# EAGLE design pcb5 (EAGLE 7.1.0)
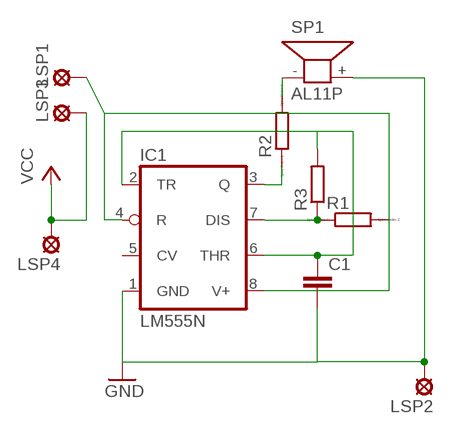
[diagram p0: schematic, sheet 1]

## Parts
C1  C-EU025-024X044  [C025-024X044]
IC1  LM555N  [DIL08]
LSP1  MCS08  [MCS08]
LSP2  MCS08  [MCS08]
LSP3  MCS08  [MCS08]
LSP4  MCS08  [MCS08]
R1  R-EU_0204_7  [0204/7]
R2  R-EU_0204_7  [0204/7]
R3  R-EU_0204/7  [0204/7]
SP1  AL11P  [AL11P]

## Nets
GND: C1.2 IC1.1(GND) LSP2.MP SP1.+
N$1: IC1.3(Q) R2.1
N$2: IC1.7(DIS) R1.1 R3.1
N$3: R2.2 SP1.-
N$4: C1.1 IC1.2(TR) IC1.6(THR) R3.2
N$7: IC1.4(R) IC1.8(V+) LSP1.MP R1.2
VCC: LSP3.MP LSP4.MP
Unconnected: IC1.5(CV)

## Library data of the parts
C1 = rcl:C-EU: CAPACITOR, European symbol
IC1 = linear:*555: TIMER
LSP1-LSP4 = solpad:MCS08: SOLDER PAD MC S0,8, drill 1.2 mm, distributor Buerklin, 08F130
R1 R2 = resistor:R-EU_: RESISTOR, European symbol; SPICEPREFIX: R
R3 = rcl:R-EU_: RESISTOR, European symbol
SP1 = buzzer:AL11P: SPEAKER Source: Buerklin; OC_FARNELL: unknown; OC_NEWARK: unknown

## Board
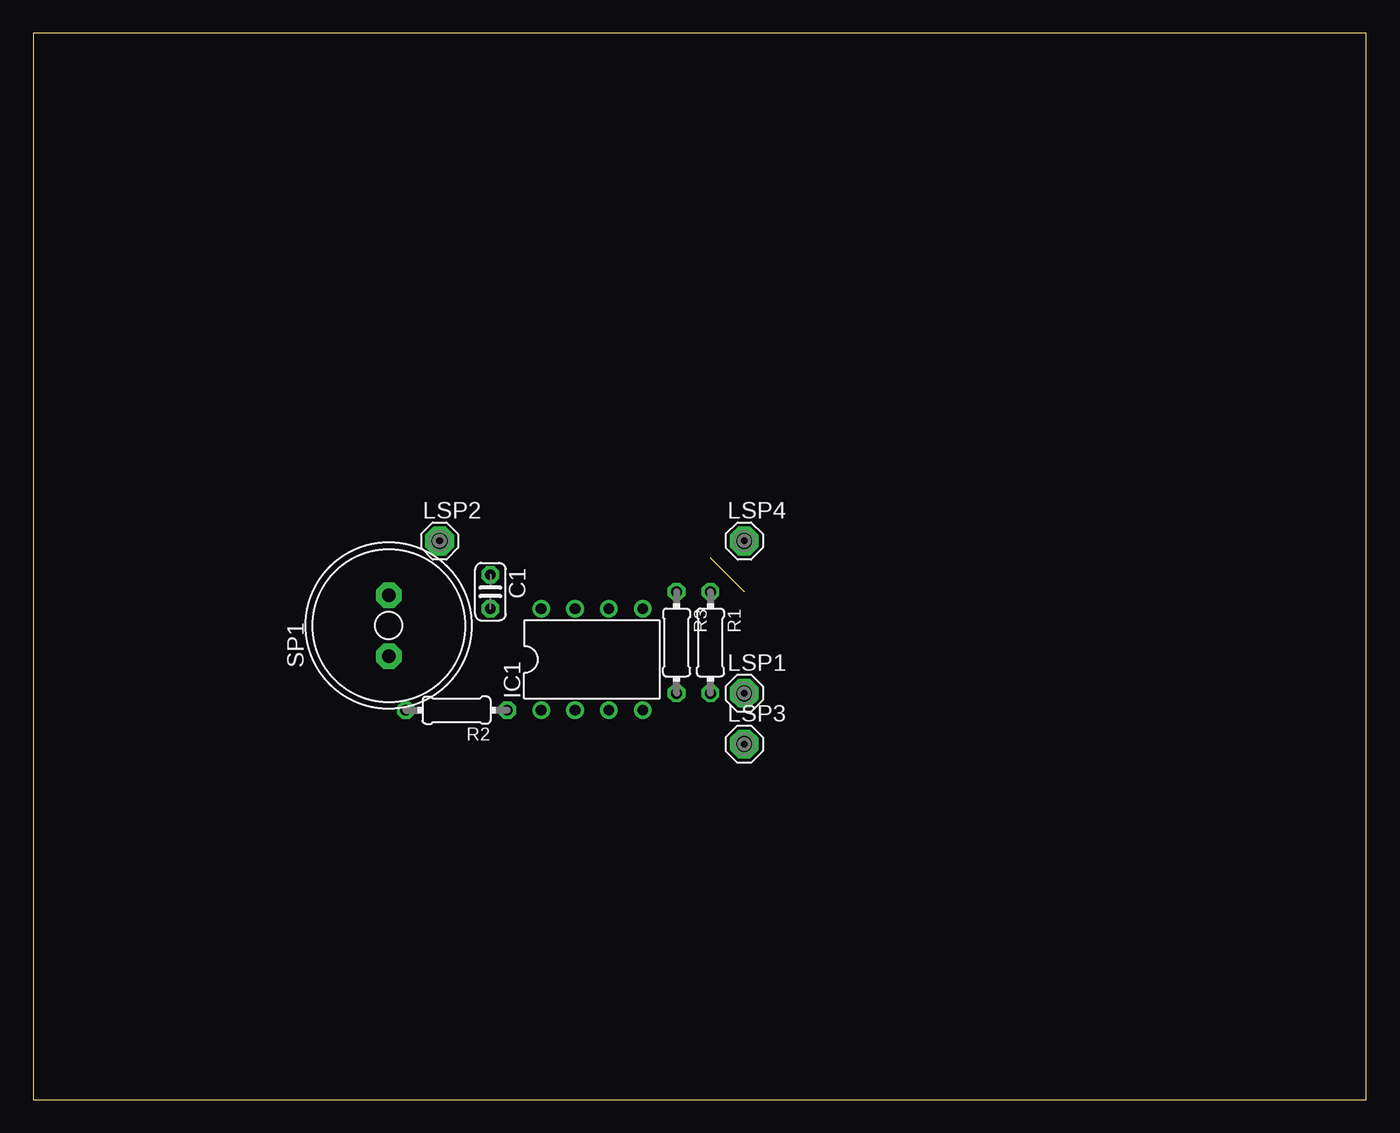
[diagram p1: board, top side]
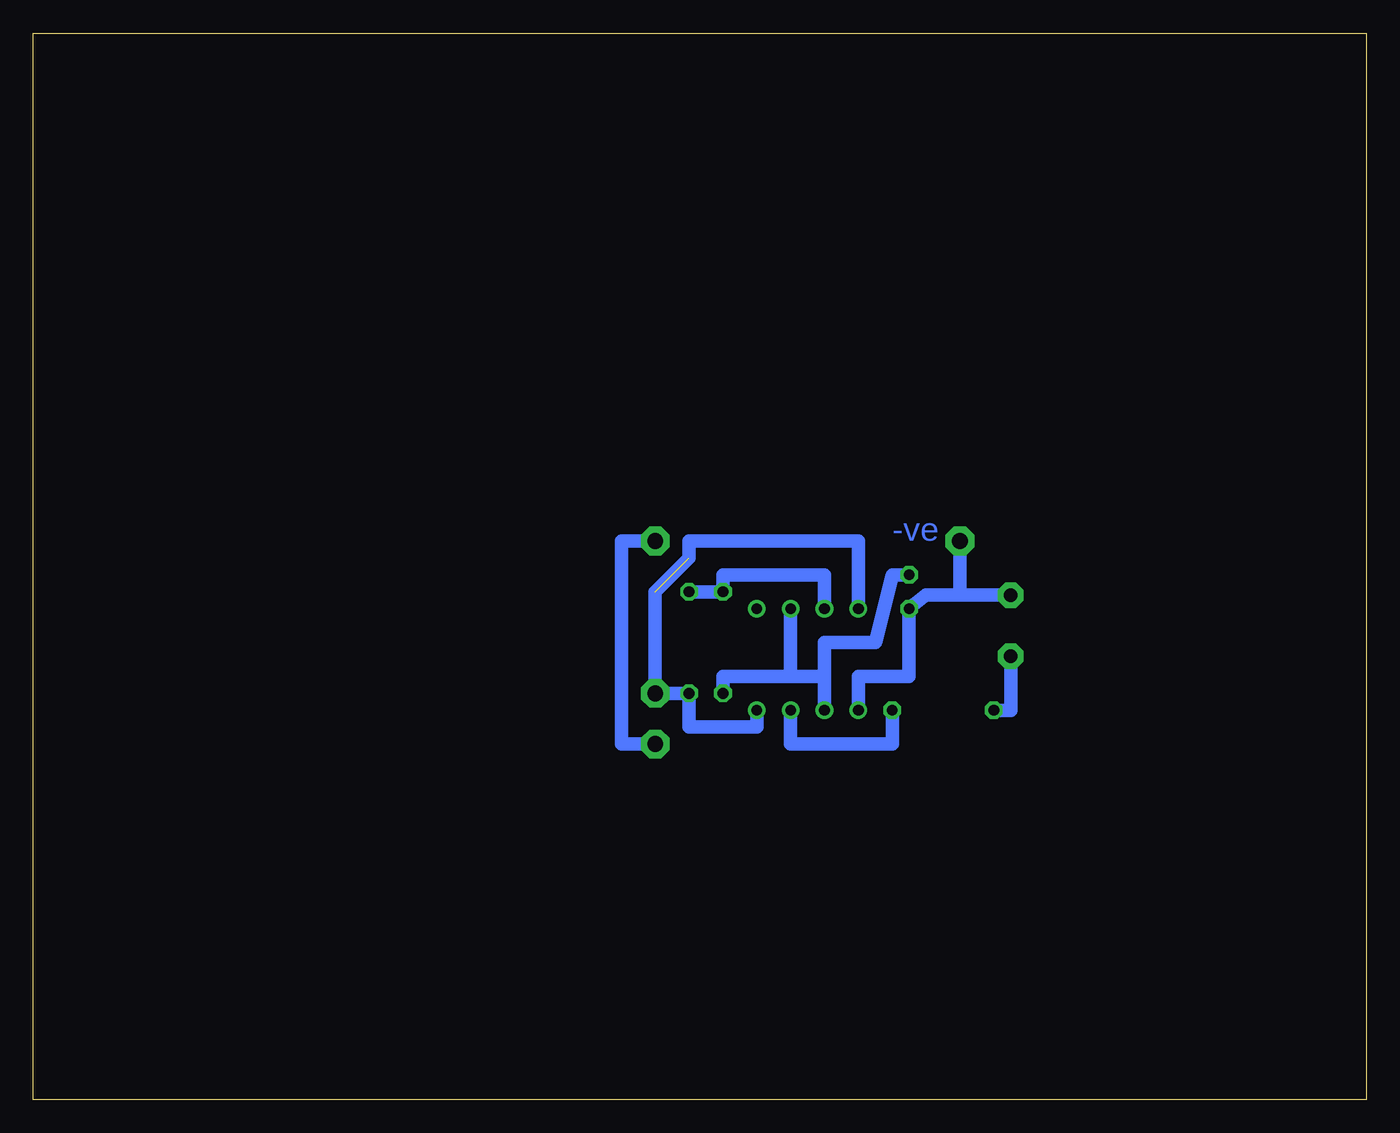
[diagram p2: board, bottom side, seen from below]

Size 100 x 80 mm. Coordinates in mm from the lower left corner, seen from the top.
Outline: 0,0 100,0 100,80 0,80 0,0
Copper layers (1*16): Top 0.035mm / dielectric 1.5mm / Bottom 0.035mm
Design rules "default": minimum track width 10mil, minimum drill 24mil, track to track 8mil, track to pad 8mil, pad to pad 8mil, via to via 8mil, smd to smd 8mil, copper to edge 40mil, drill to drill 8mil, minimum pad ring 10mil, minimum via ring 8mil, stop-mask expansion 4mil, vias tented up to drill 0mil, thermal gap 10mil

### Footprints (pad centres in the part's own frame; a part is rotated, then mirrored left to right if it is on the bottom)
C025-024X044 = drill 0.813 octagon: 1 -1.27,0; 2 1.27,0
DIL08 = drill 0.813 pad 1.27: 1 -3.81,-3.81; 2 -1.27,-3.81; 3 1.27,-3.81; 4 3.81,-3.81; 5 3.81,3.81; 6 1.27,3.81; 7 -1.27,3.81; 8 -3.81,3.81
MCS08 = drill 1.194 pad 2.159 octagon: MP 0,0
0204/7 = drill 0.813 octagon: 1 -3.81,0; 2 3.81,0
AL11P = drill 1.016 pad 1.905 octagon: + 2.286,0; - -2.286,0

### Placement (x,y rotation side)
C1  34.29,38.1 270 top
IC1  41.91,33.02 0 top
LSP1  53.34,30.48 0 top
LSP2  30.48,41.91 0 top
LSP3  53.34,26.67 0 top
LSP4  53.34,41.91 0 top
R1  50.8,34.29 270 top
R2  31.75,29.21 180 top
R3  48.26,34.29 270 top
SP1  26.67,35.56 90 top

### Tracks (layer width: path | path; a pad name or v marks a point on that pad's centre or on a via)
GND
  Bottom 1.016: IC1.1 38.1,31.75 34.29,31.75 C1.2 33.02,37.85 30.48,37.85 | SP1.+ 30.48,37.85 | LSP2.MP 30.48,37.85
N$1
  Bottom 1.016: R2.1 35.56,26.67 43.18,26.67 IC1.3
N$2
  Bottom 1.016: R1.1 R3.1 48.26,39.37 40.64,39.37 IC1.7
N$3
  Bottom 1.016: R2.2 26.67,29.21 SP1.-
N$4
  Bottom 1.016: IC1.6 43.18,31.75 | 43.18,31.75 48.26,31.75 R3.2 | IC1.2 40.64,31.75 | 40.64,31.75 43.18,31.75 | C1.1 35.56,39.37 36.83,34.29 40.64,34.29 40.64,31.75
N$7  (1 unrouted)
  Bottom 1.016: IC1.8 38.1,41.91 50.8,41.91 50.8,40.64 53.34,38.1 LSP1.MP R1.2 50.8,27.94 45.72,27.94 IC1.4
VCC
  Bottom 1.016: LSP3.MP 55.88,26.67 55.88,41.91 LSP4.MP

### Text on the board
Bottom: -ve